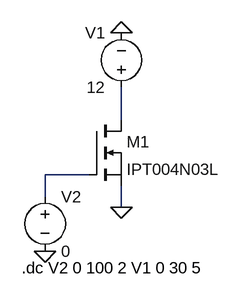
[diagram p0: schematic Mosfet Sweep.asc]
Mosfet Sweep.asc, the LTspice schematic file:
Version 4
SHEET 1 880 680
WIRE 208 96 208 48
WIRE 160 176 96 176
WIRE 96 208 96 176
WIRE 208 224 208 192
FLAG 96 288 0
FLAG 208 -32 0
FLAG 208 224 0
SYMBOL nmos 160 96 R0
SYMATTR InstName M1
SYMATTR Value IPT004N03L
SYMBOL voltage 208 64 R180
WINDOW 0 24 96 Left 2
WINDOW 3 24 16 Left 2
WINDOW 123 0 0 Left 0
WINDOW 39 0 0 Left 0
SYMATTR InstName V1
SYMATTR Value 12
SYMBOL voltage 96 192 R0
WINDOW 123 0 0 Left 0
WINDOW 39 0 0 Left 0
SYMATTR InstName V2
SYMATTR Value 0
TEXT 62 312 Left 2 !.dc V2 0 100 2 V1 0 30 5

The netlist it stands for:
* Mosfet Sweep.asc
M1 N001 N002 0 0 IPT004N03L
V1 N001 0 12
V2 N002 0 0
.model NMOS NMOS
.model PMOS PMOS
.lib standard.mos
.dc V2 0 100 2 V1 0 30 5
.backanno
.end